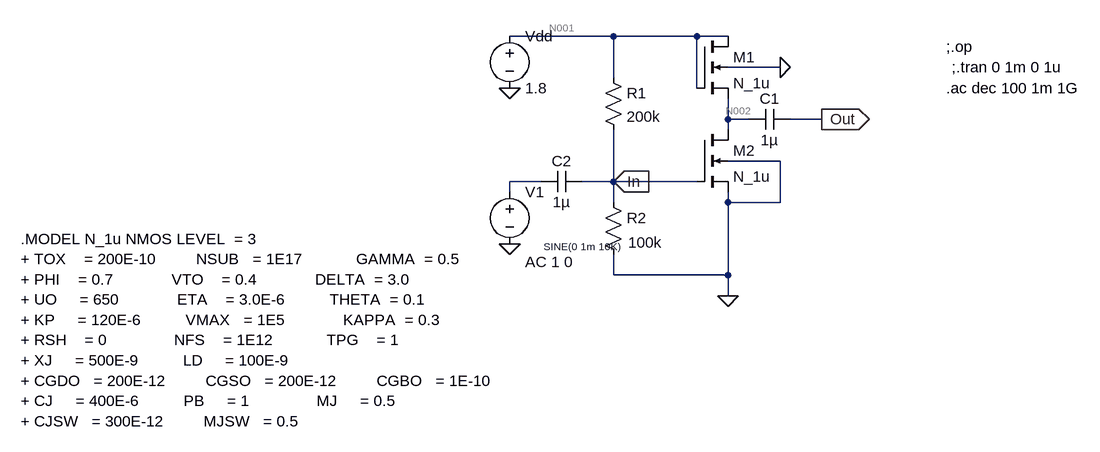
[diagram p0: schematic csd.asc]
csd.asc, the LTspice schematic file:
Version 4
SHEET 1 880 680
WIRE 0 48 -160 48
WIRE 128 48 0 48
WIRE 176 48 128 48
WIRE 256 96 176 96
WIRE 0 112 0 48
WIRE 128 128 128 48
WIRE 176 176 176 144
WIRE 208 176 176 176
WIRE 320 176 272 176
WIRE 176 192 176 176
WIRE 256 240 176 240
WIRE -112 272 -160 272
WIRE 0 272 0 192
WIRE 0 272 -48 272
WIRE 128 272 0 272
WIRE -160 288 -160 272
WIRE 0 304 0 272
WIRE 176 304 176 288
WIRE 256 304 256 240
WIRE 256 304 176 304
WIRE 0 416 0 384
WIRE 176 416 176 304
WIRE 176 416 0 416
WIRE 176 448 176 416
FLAG -160 128 0
FLAG 176 448 0
FLAG 0 272 In
IOPIN 0 272 In
FLAG 320 176 Out
IOPIN 320 176 Out
FLAG -160 368 0
FLAG 256 96 0
SYMBOL nmos4 128 48 R0
SYMATTR InstName M1
SYMATTR Value N_1u
SYMATTR Value2 l=50u w=50u
SYMBOL nmos4 128 192 R0
SYMATTR InstName M2
SYMATTR Value N_1u
SYMATTR Value2 l=10u w=250u
SYMBOL res -16 96 R0
SYMATTR InstName R1
SYMATTR Value 200k
SYMBOL res -16 288 R0
WINDOW 3 65 62 Top 2
SYMATTR InstName R2
SYMATTR Value 100k
SYMBOL voltage -160 32 R0
WINDOW 123 0 0 Left 0
WINDOW 39 0 0 Left 0
SYMATTR InstName Vdd
SYMATTR Value 1.8
SYMBOL voltage -160 272 R0
WINDOW 3 111 110 Bottom 1
WINDOW 123 24 124 Left 2
WINDOW 39 0 0 Left 0
SYMATTR InstName V1
SYMATTR Value SINE(0 1m 10K)
SYMATTR Value2 AC 1 0
SYMBOL cap 272 160 R90
WINDOW 0 0 32 VBottom 2
WINDOW 3 32 32 VTop 2
SYMATTR InstName C1
SYMATTR Value 1µ
SYMBOL cap -48 256 R90
WINDOW 0 0 32 VBottom 2
WINDOW 3 32 32 VTop 2
SYMATTR InstName C2
SYMATTR Value 1µ
TEXT -912 360 Left 2 !.MODEL N_1u NMOS LEVEL  = 3                  \n+ TOX    = 200E-10         NSUB   = 1E17            GAMMA  = 0.5          \n+ PHI    = 0.7             VTO    = 0.4             DELTA  = 3.0         \n+ UO     = 650             ETA    = 3.0E-6          THETA  = 0.1          \n+ KP     = 120E-6          VMAX   = 1E5             KAPPA  = 0.3                \n+ RSH    = 0               NFS    = 1E12            TPG    = 1                  \n+ XJ     = 500E-9          LD     = 100E-9                 \n+ CGDO   = 200E-12         CGSO   = 200E-12         CGBO   = 1E-10              \n+ CJ     = 400E-6          PB     = 1               MJ     = 0.5           \n+ CJSW   = 300E-12         MJSW   = 0.5
TEXT 512 64 Left 2 !;.op
TEXT 520 96 Left 2 !;.tran 0 1m 0 1u
TEXT 512 128 Left 2 !.ac dec 100 1m 1G

The netlist it stands for:
* csd.asc
M1 N001 N001 N002 0 N_1u l=50u w=50u
M2 N002 In 0 0 N_1u l=10u w=250u
R1 N001 In 200k
R2 In 0 100k
Vdd N001 0 1.8
V1 N003 0 SINE(0 1m 10K) AC 1 0
C1 Out N002 1µ
C2 In N003 1µ
.model NMOS NMOS
.model PMOS PMOS
.lib standard.mos
.MODEL N_1u NMOS LEVEL  = 3
+ TOX    = 200E-10         NSUB   = 1E17            GAMMA  = 0.5
+ PHI    = 0.7             VTO    = 0.4             DELTA  = 3.0
+ UO     = 650             ETA    = 3.0E-6          THETA  = 0.1
+ KP     = 120E-6          VMAX   = 1E5             KAPPA  = 0.3
+ RSH    = 0               NFS    = 1E12            TPG    = 1
+ XJ     = 500E-9          LD     = 100E-9
+ CGDO   = 200E-12         CGSO   = 200E-12         CGBO   = 1E-10
+ CJ     = 400E-6          PB     = 1               MJ     = 0.5
+ CJSW   = 300E-12         MJSW   = 0.5
;.op
;.tran 0 1m 0 1u
.ac dec 100 1m 1G
.backanno
.end

* Results of the author's LTspice run, read from the files saved beside the schematic
* Operating Point, zero values left out:
*   V(n001) = 1.8 V
*   V(n002) = 262.3 mV
*   V(in) = 600 mV
*   V(out) = 262.3 nV
*   Id(M2) = 53.56 µA
*   Is(M2) = -53.56 µA
*   Id(M1) = 53.56 µA
*   Ib(M1) = -2.082 pA
*   Is(M1) = -53.56 µA
*   I(R2) = 6 µA
*   I(R1) = 6 µA
*   I(Vdd) = -59.56 µA
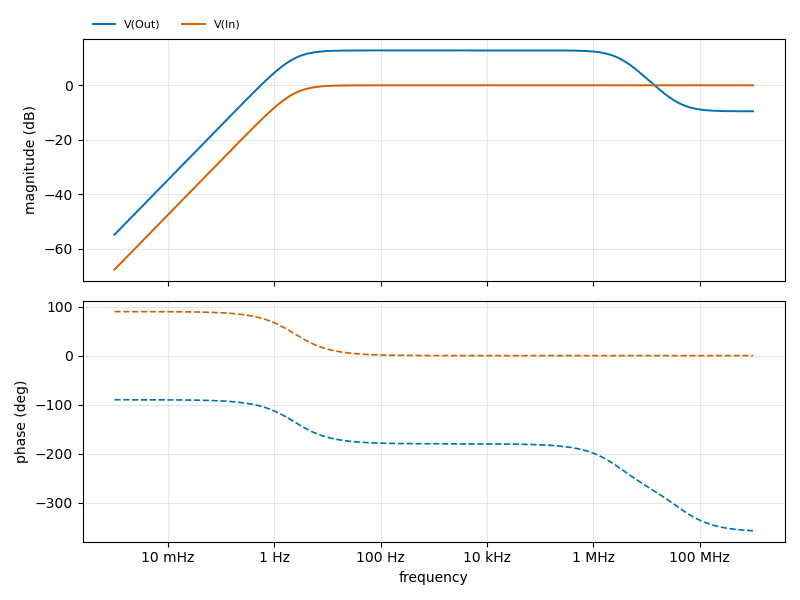
[diagram p1: AC Analysis of csd.asc, plotted from the saved traces]
* AC Analysis, 1 run:
*   V(Out): -54.76 dB at 1 mHz, -9.53 dB at 1 GHz, peak 12.80 dB at 2.754 kHz, 3 dB below the peak at 2.387 Hz and 3.134 MHz
*   V(In): -67.56 dB at 1 mHz, -0.00 dB at 1 GHz, peak -0.00 dB at 1 GHz, 3 dB below the peak at 2.387 Hz